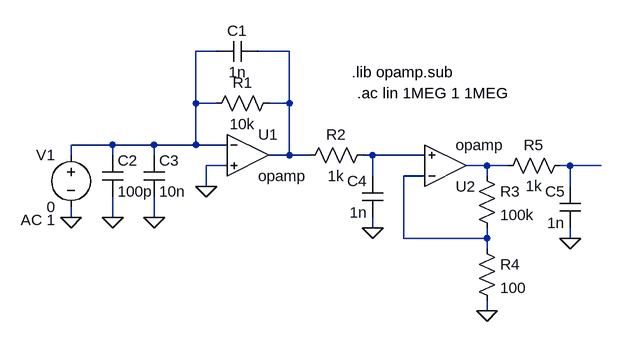
[diagram p0: schematic TIA_Jonas.asc]
TIA_Jonas.asc, the LTspice schematic file:
Version 4
SHEET 1 880 680
WIRE 64 -32 32 -32
WIRE 176 -32 128 -32
WIRE 32 48 32 -32
WIRE 64 48 32 48
WIRE 176 48 176 -32
WIRE 176 48 144 48
WIRE -96 112 -160 112
WIRE -32 112 -96 112
WIRE 32 112 32 48
WIRE 32 112 -32 112
WIRE 80 112 32 112
WIRE -160 128 -160 112
WIRE -96 128 -96 112
WIRE -32 128 -32 112
WIRE 176 128 176 48
WIRE 176 128 144 128
WIRE 208 128 176 128
WIRE 304 128 288 128
WIRE 384 128 304 128
WIRE 80 144 48 144
WIRE 480 144 448 144
WIRE 512 144 480 144
WIRE 608 144 592 144
WIRE 656 144 608 144
WIRE 304 160 304 128
WIRE 384 160 352 160
WIRE 480 160 480 144
WIRE 48 176 48 144
WIRE 608 176 608 144
WIRE -160 224 -160 208
WIRE -96 224 -96 192
WIRE -32 224 -32 192
WIRE 304 240 304 224
WIRE 352 256 352 160
WIRE 480 256 480 240
WIRE 480 256 352 256
WIRE 608 256 608 240
WIRE 480 272 480 256
WIRE 480 368 480 352
FLAG -160 224 0
FLAG -96 224 0
FLAG -32 224 0
FLAG 48 176 0
FLAG 304 240 0
FLAG 480 368 0
FLAG 608 256 0
SYMBOL OpAmps\\opamp 112 64 R0
SYMATTR InstName U1
SYMBOL res 160 32 R90
WINDOW 0 0 56 VBottom 2
WINDOW 3 32 56 VTop 2
SYMATTR InstName R1
SYMATTR Value 10k
SYMBOL cap 128 -48 R90
WINDOW 0 0 32 VBottom 2
WINDOW 3 32 32 VTop 2
SYMATTR InstName C1
SYMATTR Value 1n
SYMBOL voltage -160 112 M0
WINDOW 123 24 116 Left 2
WINDOW 39 0 0 Left 0
SYMATTR Value2 AC 1
SYMATTR InstName V1
SYMATTR Value 0
SYMBOL cap -112 128 R0
SYMATTR InstName C2
SYMATTR Value 100p
SYMBOL cap -48 128 R0
SYMATTR InstName C3
SYMATTR Value 10n
SYMBOL OpAmps\\opamp 416 208 M180
SYMATTR InstName U2
SYMBOL res 304 112 R90
WINDOW 0 0 56 VBottom 2
WINDOW 3 32 56 VTop 2
SYMATTR InstName R2
SYMATTR Value 1k
SYMBOL cap 320 160 M0
SYMATTR InstName C4
SYMATTR Value 1n
SYMBOL res 464 144 R0
SYMATTR InstName R3
SYMATTR Value 100k
SYMBOL res 464 256 R0
SYMATTR InstName R4
SYMATTR Value 100
SYMBOL res 608 128 R90
WINDOW 0 0 56 VBottom 2
WINDOW 3 32 56 VTop 2
SYMATTR InstName R5
SYMATTR Value 1k
SYMBOL cap 624 176 M0
SYMATTR InstName C5
SYMATTR Value 1n
TEXT 272 0 Left 2 !.lib opamp.sub
TEXT 280 32 Left 2 !.ac lin 1MEG 1 1MEG

The netlist it stands for:
* TIA_Jonas.asc
XU1 N001 0 N002 opamp Aol=100K GBW=10Meg  ; pins invin noninvin out
R1 N002 N001 10k
C1 N002 N001 1n
V1 N001 0 0 AC 1
C2 N001 0 100p
C3 N001 0 10n
XU2 N006 N003 N004 opamp Aol=100K GBW=10Meg  ; pins invin noninvin out
R2 N003 N002 1k
C4 N003 0 1n
R3 N004 N006 100k
R4 N006 0 100
R5 N005 N004 1k
C5 N005 0 1n
.lib opamp.sub
.ac lin 1MEG 1 1MEG
.backanno
.end